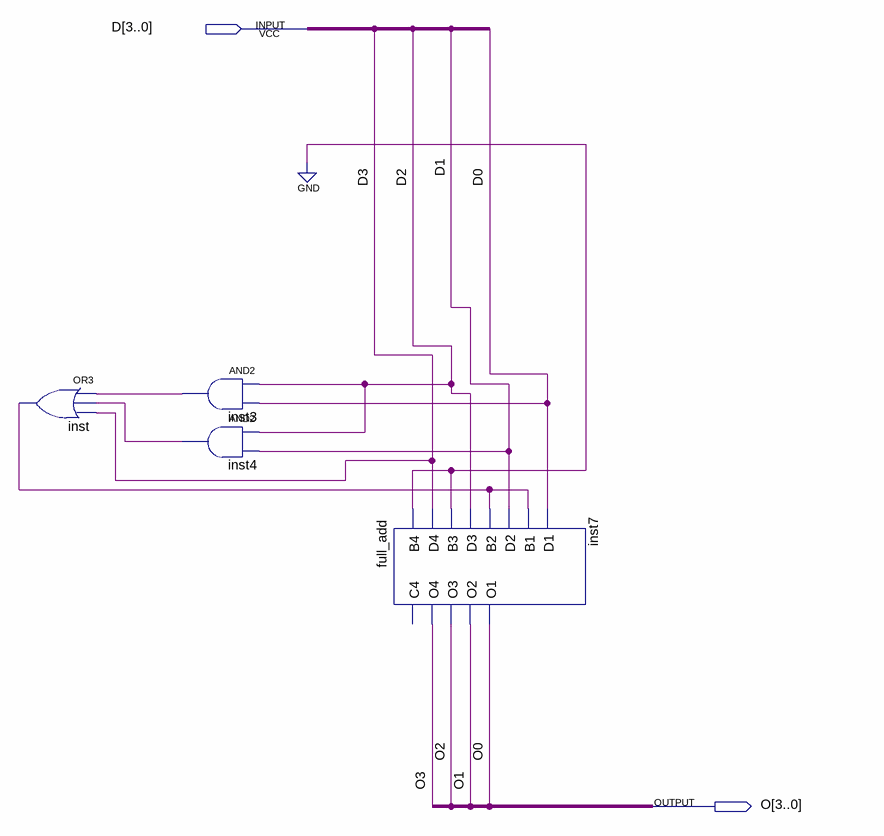
[diagram p0: schematic sheet]
// Quartus schematic newfive_add_three.bdf as structural Verilog: 4 symbols, 2 pins
module newfive_add_three (
  input  [3:0] D,
  output [3:0] O
);

  wire inst3_out, inst4_out, inst_out;

  or inst (inst_out, inst3_out, inst4_out, D[3]);
  and inst3 (inst3_out, D[2], D[0]);
  and inst4 (inst4_out, D[2], D[1]);
  full_add inst7 (
    .B4(1'b0), .D4(D[3]), .B3(1'b0), .D3(D[2]), .B2(inst_out), .D2(D[1]), .B1(inst_out), .D1(D[0]),
    .O4(O[3]), .O3(O[2]), .O2(O[1]), .O1(O[0]));  // open: C4
endmodule
